# Altium schematic sheet sb-sonata-fpgapwr2.SchDoc: <Enter Sheet Title>
size Letter; Organization: NewAE Technology Inc.; Address1: 1083 Queen St., Suite 196; Address2: Halifax; Address3: NS; Address4: Canada B3H 0B2; SheetNumber: 15; SheetTotal: 22; SheetApproved: NO
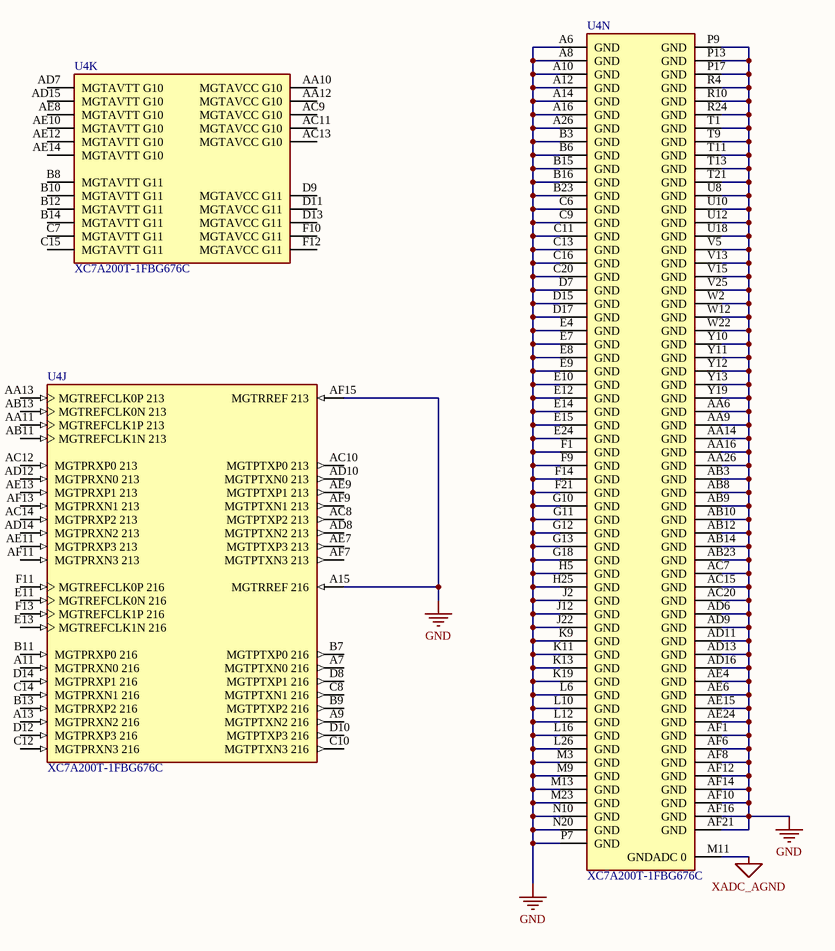
[diagram p0: sb-sonata-fpgapwr2.SchDoc]

## Parts
U4  XC7A200T-1FBG676C  [FP-XC7A200T-1FBG676C-MFG]  (parts J,K,N of 14)

## Nets
GND: U4.A6(GND) U4.A8(GND) U4.A10(GND) U4.A12(GND) U4.A14(GND) U4.A15(MGTRREF_216) U4.A16(GND) U4.A26(GND) U4.AA6(GND) U4.AA9(GND) U4.AA14(GND) U4.AA16(GND) U4.AA26(GND) U4.AB3(GND) U4.AB8(GND) U4.AB9(GND) U4.AB10(GND) U4.AB12(GND) U4.AB14(GND) U4.AB23(GND) U4.AC7(GND) U4.AC15(GND) U4.AC20(GND) U4.AD6(GND) U4.AD9(GND) U4.AD11(GND) U4.AD13(GND) U4.AD16(GND) U4.AE4(GND) U4.AE6(GND) U4.AE15(GND) U4.AE24(GND) U4.AF1(GND) U4.AF6(GND) U4.AF8(GND) U4.AF10(GND) U4.AF12(GND) U4.AF14(GND) U4.AF15(MGTRREF_213) U4.AF16(GND) U4.AF21(GND) U4.B3(GND) U4.B6(GND) U4.B15(GND) U4.B16(GND) U4.B23(GND) U4.C6(GND) U4.C9(GND) U4.C11(GND) U4.C13(GND) U4.C16(GND) U4.C20(GND) U4.D7(GND) U4.D15(GND) U4.D17(GND) U4.E4(GND) U4.E7(GND) U4.E8(GND) U4.E9(GND) U4.E10(GND) U4.E12(GND) U4.E14(GND) U4.E15(GND) U4.E24(GND) U4.F1(GND) U4.F9(GND) U4.F14(GND) U4.F21(GND) U4.G10(GND) U4.G11(GND) U4.G12(GND) U4.G13(GND) U4.G18(GND) U4.H5(GND) U4.H25(GND) U4.J2(GND) U4.J12(GND) U4.J22(GND) U4.K9(GND) U4.K11(GND) U4.K13(GND) U4.K19(GND) U4.L6(GND) U4.L10(GND) U4.L12(GND) U4.L16(GND) U4.L26(GND) U4.M3(GND) U4.M9(GND) U4.M13(GND) U4.M23(GND) U4.N10(GND) U4.N20(GND) U4.P7(GND) U4.P9(GND) U4.P13(GND) U4.P17(GND) U4.R4(GND) U4.R10(GND) U4.R24(GND) U4.T1(GND) U4.T9(GND) U4.T11(GND) U4.T13(GND) U4.T21(GND) U4.U8(GND) U4.U10(GND) U4.U12(GND) U4.U18(GND) U4.V5(GND) U4.V13(GND) U4.V15(GND) U4.V25(GND) U4.W2(GND) U4.W12(GND) U4.W22(GND) U4.Y10(GND) U4.Y11(GND) U4.Y12(GND) U4.Y13(GND) U4.Y19(GND)
XADC_AGND: U4.M11(GNDADC_0)

Not connected (* = marked no-connect by the designer): U4 A7(MGTPTXN0_216) A9(MGTPTXN2_216) A11(MGTPRXN0_216) A13(MGTPRXN2_216) AA10(MGTAVCC_G10) AA11(MGTREFCLK1P_213) AA12(MGTAVCC_G10) AA13(MGTREFCLK0P_213) AB11(MGTREFCLK1N_213) AB13(MGTREFCLK0N_213) AC8(MGTPTXP2_213) AC9(MGTAVCC_G10) AC10(MGTPTXP0_213) AC11(MGTAVCC_G10) AC12(MGTPRXP0_213) AC13(MGTAVCC_G10) AC14(MGTPRXP2_213) AD7(MGTAVTT_G10) AD8(MGTPTXN2_213) AD10(MGTPTXN0_213) AD12(MGTPRXN0_213) AD14(MGTPRXN2_213) AD15(MGTAVTT_G10) AE7(MGTPTXP3_213) AE8(MGTAVTT_G10) AE9(MGTPTXP1_213) AE10(MGTAVTT_G10) AE11(MGTPRXP3_213) AE12(MGTAVTT_G10) AE13(MGTPRXP1_213) AE14(MGTAVTT_G10) AF7(MGTPTXN3_213) AF9(MGTPTXN1_213) AF11(MGTPRXN3_213) AF13(MGTPRXN1_213) B7(MGTPTXP0_216) B8(MGTAVTT_G11) B9(MGTPTXP2_216) B10(MGTAVTT_G11) B11(MGTPRXP0_216) B12(MGTAVTT_G11) B13(MGTPRXP2_216) B14(MGTAVTT_G11) C7(MGTAVTT_G11) C8(MGTPTXN1_216) C10(MGTPTXN3_216) C12(MGTPRXN3_216) C14(MGTPRXN1_216) C15(MGTAVTT_G11) D8(MGTPTXP1_216) D9(MGTAVCC_G11) D10(MGTPTXP3_216) D11(MGTAVCC_G11) D12(MGTPRXP3_216) D13(MGTAVCC_G11) D14(MGTPRXP1_216) E11(MGTREFCLK0N_216) E13(MGTREFCLK1N_216) F10(MGTAVCC_G11) F11(MGTREFCLK0P_216) F12(MGTAVCC_G11) F13(MGTREFCLK1P_216)

## Notes on the sheet
- Title:
- Date:
- Rev:
- Time:
- Project:
- Sheet
- of
- License:
- Copyright © NewAE Technology Inc.
- Approved:
- NewAE.com
- File:

## Library data of the parts
U4 = CMP-0364-00015-4: IC FPGA 400 I/O 676FCBGA; Manufacturer: Xilinx; Min Supply Voltage: 0.95V; Number Of Logic Elements Cells: 215360; Ciiva Ids: 8919048; Memory Type: DDR3; Max Supply Voltage: 1.05V; Number Of Registers: 269200; Number Of I/Os: 500; Max Junction Temp: +85°C; Ram Size: 13455360bits; Number Of Logic Blocks: 16825; Standoff Height: 0.4mm; Speed Grade: 1; Import Ts: 1521861070; Memory Size: 1GBytes; Lead Free: Yes; Height: 2.54mm; Octopart: https://octopart.com/xc7a200t-1fbg676c-xilinx-27810760; Ipc Land Pattern Name: BGA676C100P26X26_2700X2700X234; Manufacturer Part Number: XC7A200T-1FBG676C; Package: 0; Device Class L1: Integrated Circuits (ICs); Device Class L3: FPGAs - Field Programmable Gate Arrays; Temperature: 0°C to +85°C; Release Date: 1402465632; Temperature Range High: +85°C; Device Class L2: Embedded Processors and Controllers; RoHS: TRUE; ComponentLink2URL: https://www.xilinx.com/support/documentation/data_sheets/ds181_Artix_7_Data_Sheet.pdf; Temperature Range Low: 0°C; Digikey Description: IC FPGA 400 I/O 676FCBGA; Footprint Url: https://www.xilinx.com/support/documentation/user_guides/ug475_7Series_Pkg_Pinout.pdf; Automotive: No; Category: IC; ComponentLink2Description: Datasheet